# EAGLE design streamr_math_nap (EAGLE 9.6.2)
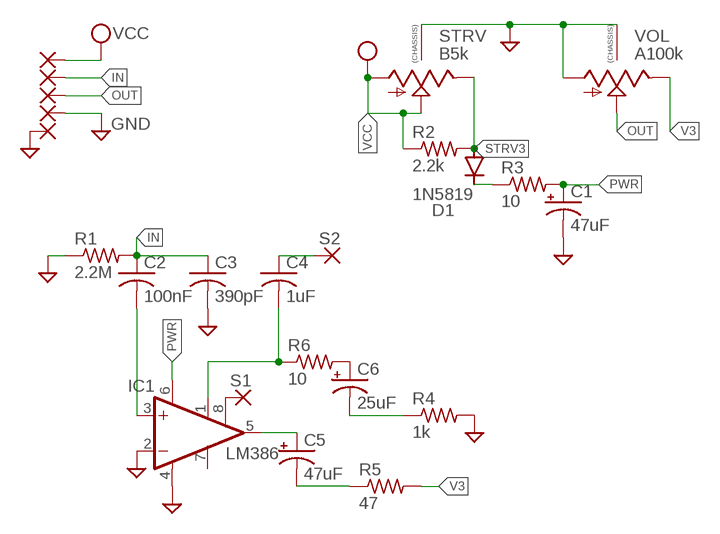
[diagram p0: schematic, sheet 1]

## Parts
C1  47uF  CAP_SMD+THRUPAN_C  [PAN_C_SMD+THRU]
C2  100nF  C-USC0805  [C0805]
C3  390pF  C-USC0805  [C0805]
C4  1uF  C-USC0805  [C0805]
C5  47uF  CAP_SMD+THRUPAN_C  [PAN_C_SMD+THRU]
C6  25uF  CAP_SMD+THRUPAN_C  [PAN_C_SMD+THRU]
D1  1N5819  DIODE-SOD123  [SOD123]
IC1  LM386  LM386M-1  [SO08]
PAD1  1,6/0,8  [1,6/0,8]
PAD2  1,6/0,8  [1,6/0,8]
PAD3  1,6/0,8  [1,6/0,8]
PAD4  1,6/0,8  [1,6/0,8]
PAD5  1,6/0,8  [1,6/0,8]
R1  2.2M  R-US_R0805  [R0805]
R2  2.2k  R-US_R1206  [R1206]
R3  10  R-US_R1206  [R1206]
R4  1k  R-US_R1206  [R1206]
R5  47  R-US_R1206  [R1206]
R6  10  R-US_R1206  [R1206]
S1  S1  1,6/0,8  [1,6/0,8]
S2  S2  1,6/0,8  [1,6/0,8]
STRV  B5k  9MM_SNAP-IN_POT_CHASSIS  [9MM_SNAP-IN_POT]
VOL  A100k  9MM_SNAP-IN_POT_CHASSIS  [9MM_SNAP-IN_POT]

## Nets
GND: C1.- C1.--(-) C3.2 IC1.2(-IN) IC1.4(GND) PAD4.1(P) PAD5.1(P) R1.1 R4.2 STRV.CHASSIS1 STRV.CHASSIS2 VOL.1(A) VOL.CHASSIS1 VOL.CHASSIS2
IN: C2.1 C3.1 PAD2.1(P) R1.2
N$1: IC1.8(GAIN) S1.1(P)
N$2: C2.2 IC1.3(+IN)
N$3: D1.C R3.1
N$4: C4.2 IC1.1(GAIN) R6.1
N$5: C5.+ C5.++(+) IC1.5(OUT)
N$6: C5.- C5.--(-) R5.1
N$7: C6.+ C6.++(+) R6.2
N$8: C6.- C6.--(-) R4.1
N$9: C4.1 S2.1(P)
OUT: PAD3.1(P) VOL.2(S)
PWR: C1.+ C1.++(+) IC1.6(VS) R3.2
STRV3: D1.A R2.2 STRV.3(E)
V3: R5.2 VOL.3(E)
VCC: PAD1.1(P) R2.1 STRV.1(A) STRV.2(S)
Unconnected: IC1.7(BYPASS)

## Library data of the parts
C1 C5 C6 = MusicThingModular:CAP_SMD+THRU
C2-C4 = adafruit:C-US: CAPACITOR, American symbol
D1 = diode:DIODE-: DIODE
IC1 = linear:LM386?-*: Low Voltage Audio Power Amplifier Source: http://cache.national.com/ds/LM/LM386.pdf
PAD1-PAD5 S1 S2 = wirepad:1,6/0,8: THROUGH-HOLE PAD
R1-R6 = adafruit:R-US_: RESISTOR, American symbol
STRV VOL = MusicThingModular:9MM_SNAP-IN_POT_CHASSIS: 9mm vertical snap-in pot, Alpha / Panasonic style, with a connection to the metal chassis for grounding

## Board
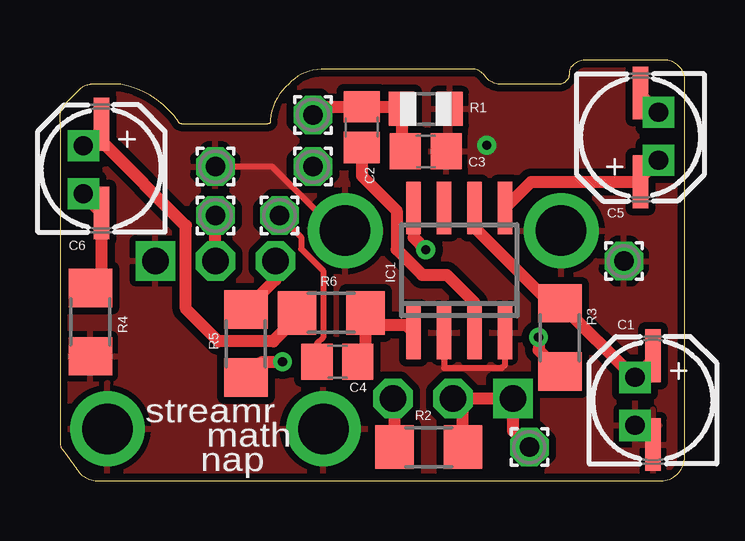
[diagram p1: board, top side]
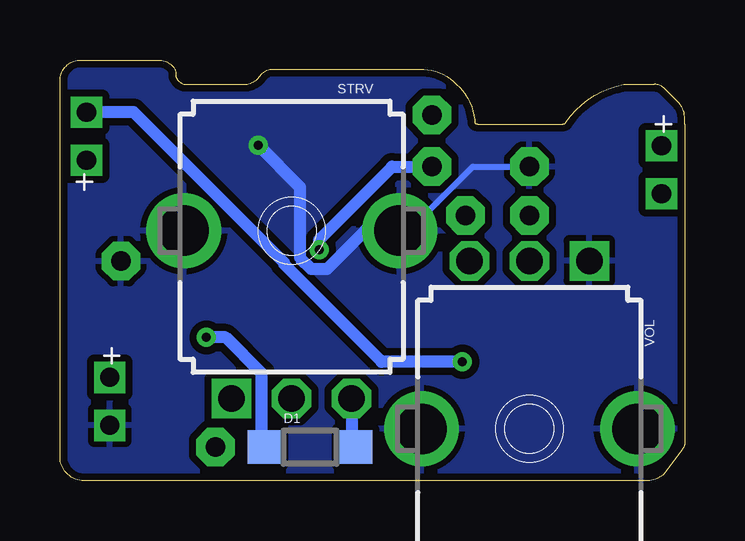
[diagram p2: board, bottom side, seen from below]

Size 26.04 x 17.53 mm. Coordinates in mm from the lower left corner, seen from the top.
Outline: 0,14.86 0,1.65 0,1.58 arc45 0.13,1.27 0.85,0.29 arc45 1.56,0 25.04,0 arc90 26.04,1 26.04,16.66 arc45 25.78,17.27 arc45 25.17,17.53 21.95,17.53 arc45 21.34,17.27 arc45 21.21,16.96 21.21,16.89 arc-45 21.12,16.67 21.08,16.64 arc-45 20.77,16.51 18.39,16.51 arc-45 17.78,16.76 arc45 17.29,17.14 10.88,17.14 arc45 9.53,16.51 arc45 8.76,15.03 8.76,14.91 arc-45 8.64,14.86 arc-45 8.58,14.86 5.13,14.86 arc-45 5.08,14.86 arc-45 4.95,14.91 4.95,14.93 arc45 2.54,16.51 1.27,16.51 arc45 0.84,16.33 0.29,15.79 arc45 0,15.08 0,14.86
Copper layers (1*16): Top 0.035mm / dielectric 1.5mm / Bottom 0.035mm
Design rules "default *": minimum track width 6mil, minimum drill 0.35mm, track to track 6mil, track to pad 6mil, pad to pad 6mil, via to via 6mil, smd to smd 6mil, copper to edge 10mil, drill to drill 6mil, minimum pad ring 10mil, minimum via ring 8mil, stop-mask expansion 4mil, vias tented up to drill 0mil, thermal gap 10mil

### Footprints (pad centres in the part's own frame; a part is rotated, then mirrored left to right if it is on the bottom)
PAN_C_SMD+THRU = smd 2.2 x 0.65: + 1.9,-0.2; - -1.8,-0.2 | drill 0.8 pad 0.9 square: ++ 1,0.55; -- -1,0.55
C0805 = smd 1.3 x 1.5: 1 -0.85,0; 2 0.85,0
SOD123 = smd 1.4 x 1.4: A 1.9,0; C -1.9,0
SO08 = smd 0.6 x 2.2: 1 -1.905,-2.6; 2 -0.635,-2.6; 3 0.635,-2.6; 4 1.905,-2.6; 5 1.905,2.6; 6 0.635,2.6; 7 -0.635,2.6; 8 -1.905,2.6
1,6/0,8 = drill 0.813 pad 1.6 octagon: 1 0,0
R0805 = smd 1.1 x 1.4: 1 -1,0; 2 1,0
R1206 = smd 1.6 x 1.803: 1 -1.422,0; 2 1.422,0
9MM_SNAP-IN_POT = drill 1.1 square: 1 -2.5,-7 | drill 1.1 octagon: 2 0,-7; 3 2.5,-7 | drill 2.1 pad 2.794: CHASSIS1 -4.5,0; CHASSIS2 4.5,0

### Placement (x,y rotation side)
C1  24.51,3.3 90 top
C2  12.57,14.73 270 top
C3  15.24,13.72 0 top
C4  11.56,4.95 0 top
C5  24.38,14.35 270 top
C6  1.52,12.95 90 top
D1  15.62,1.4 0 bottom
IC1  16.64,8.76 0 top
PAD1  19.56,1.4 0 top
PAD2  10.54,15.24 0 top
PAD3  6.48,11.05 0 top
PAD4  23.5,9.14 0 top
PAD5  6.48,13.08 0 top
R1  15.24,15.49 180 top
R2  15.37,1.4 180 top
R3  20.83,5.97 90 top
R4  1.27,6.6 270 top
R5  7.75,5.71 90 top
R6  11.3,6.99 180 top
S1  10.54,13.08 0 top
S2  9.14,11.05 0 top
STRV  16.38,10.41 0 bottom
VOL  6.48,2.16 180 bottom

### Tracks (layer width: path | path; a pad name or v marks a point on that pad's centre or on a via)
GND  (via drill 0.38)
  Top 0.254: STRV.CHASSIS2 11.5,10.41 8.84,13.08 PAD5.1 | IC1.2 16,4.7 18.41,4.7 18.54,4.83 IC1.4
  Bottom 0.254: STRV.CHASSIS2 11.5,10.41 8.84,13.08 PAD5.1
  Bottom 0.508: v17.78,13.97 16.04,12.23 16.04,9.29 15.57,8.83 14.91,8.83 13.32,10.41 STRV.CHASSIS2
  pour Top (isolate 0.305): -1.27,-1.27 27.94,-1.27 27.94,17.78 -1.27,17.78
  pour Bottom (isolate 0.305): -1.27,17.78 -1.27,-1.27 27.94,-1.27 27.94,17.78
IN
  Top 0.254: 14.15,15.58 R1.2 | 14.24,13.87 C3.1
  Top 0.508: PAD2.1 10.88,15.58 C2.1 14.15,15.58 | R1.2 14.24,13.87
N$1  (via drill 0.38)
  Top 0.508: IC1.8 14.73,10.13 v15.24,9.63
  Bottom 0.508: v15.24,9.63 15.24,10.03 12.19,13.08 S1.1
N$2
  Top 0.508: C2.2 12.57,12.7 14.03,11.25 14.03,9.63 15.09,8.57 16.11,8.57 17.27,7.41 IC1.3
N$3  (via drill 0.38)
  Top 0.508: v19.94,5.97 19.94,5.44 R3.1
  Bottom 0.508: v19.94,5.97 19.14,5.97 17.65,4.48 17.65,1.52 D1.C
N$4
  Top 0.254: 12.83,6.48 12.72,6.58 R6.1 | 12.72,5.27 C4.2
  Top 0.508: IC1.1 14.42,6.48 12.83,6.48 | R6.1 12.72,5.27
N$5
  Top 0.254: C5.+ 24.18,12.6
  Top 0.508: IC1.5 19.63,12.45 C5.+ | 24.18,12.6 C5.++
N$6  (via drill 0.38)
  Top 0.254: 24.18,16.1 C5.-
  Top 0.508: R5.1 8.41,4.95 v9.27,4.95 | C5.-- 24.18,16.1
  Bottom 0.508: C5.-- 22.97,15.35 16.7,9.08 16.7,9.02 12.63,4.95 v9.27,4.95
N$7
  Top 0.254: 1.72,14.17 1.65,14.1
  Top 0.508: R6.2 9.88,6.79 8.89,5.8 6.6,5.8 5.25,7.16 5.25,10.63 1.78,14.1 1.65,14.1 1.12,14.1 C6.++ | C6.+ 1.72,14.17
N$8
  Top 0.254: 0.97,11.9 C6.--
  Top 0.508: 0.97,11.9 C6.- 1.72,8.48 R4.1
N$9
  Top 0.254: S2.1 10.05,10.15 10.05,9.65 10.96,8.74 10.96,5.97 10.71,5.71 C4.1
OUT
  Top 0.508: VOL.2 PAD3.1
PWR
  Top 0.254: 23.92,4.3 C1.++ | 24.71,5.05 C1.+
  Top 0.508: IC1.6 17.27,10.54 20.42,7.39 R3.2 23.92,4.3 | C1.++ 24.71,5.05
STRV3
  Top 0.254: 13.95,3.35 STRV.3
  Top 0.508: R2.2 13.95,3.35
  Bottom 0.254: 13.88,1.56 D1.A
  Bottom 0.508: STRV.3 13.88,1.56
V3
  Top 0.508: R5.2 8.98,8.37 VOL.3
VCC
  Top 0.508: PAD1.1 18.88,2.07 STRV.1 STRV.2 16.79,3.01 R2.1

### Text on the board
tPlace: streamr | math | nap